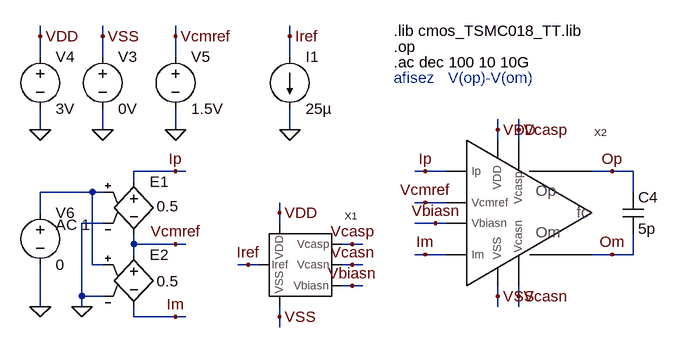
[diagram p0: schematic test_opampFC_ac.asc]
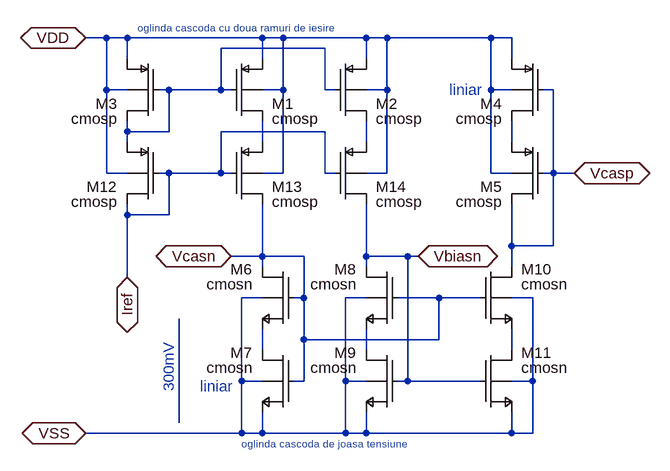
[diagram p1: sub-circuit bias.asc]
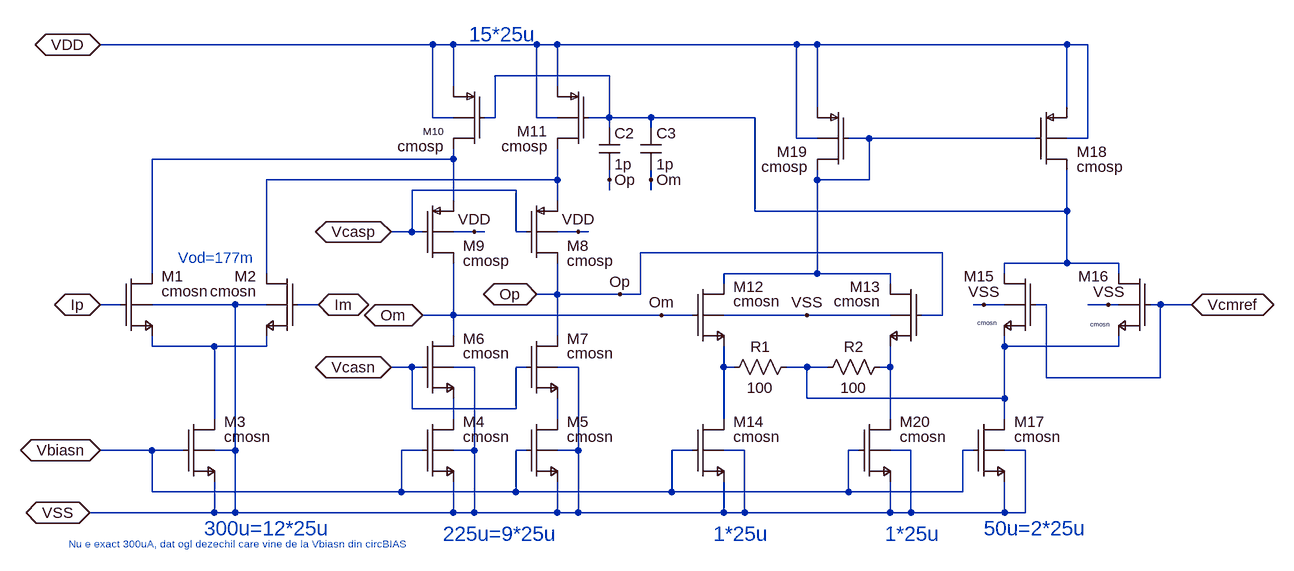
[diagram p2: sub-circuit opampfc.asc]
test_opampFC_ac.asc, the LTspice schematic file:
Version 4
SHEET 1 1072 680
WIRE -432 -432 -432 -448
WIRE -336 -432 -336 -448
WIRE -224 -432 -224 -448
WIRE -48 -432 -48 -448
WIRE -432 -400 -432 -432
WIRE -336 -400 -336 -432
WIRE -224 -400 -224 -432
WIRE -48 -400 -48 -432
WIRE -432 -288 -432 -320
WIRE -336 -288 -336 -320
WIRE -224 -288 -224 -320
WIRE -48 -288 -48 -320
WIRE 272 -288 272 -304
WIRE 304 -288 304 -304
WIRE 272 -272 272 -288
WIRE 304 -272 304 -288
WIRE -224 -224 -288 -224
WIRE -208 -224 -224 -224
WIRE 160 -224 144 -224
WIRE 192 -224 160 -224
WIRE 448 -224 416 -224
WIRE 480 -224 448 -224
WIRE -288 -208 -288 -224
WIRE -352 -192 -432 -192
WIRE -336 -192 -352 -192
WIRE 480 -192 480 -224
WIRE 160 -176 144 -176
WIRE 192 -176 160 -176
WIRE -432 -160 -432 -192
WIRE -64 -160 -64 -176
WIRE -336 -144 -368 -144
WIRE -64 -144 -64 -160
WIRE 176 -144 144 -144
WIRE 192 -144 176 -144
WIRE -288 -112 -288 -128
WIRE -224 -112 -288 -112
WIRE -208 -112 -224 -112
WIRE 48 -112 32 -112
WIRE 64 -112 48 -112
WIRE -288 -96 -288 -112
WIRE 160 -96 144 -96
WIRE 192 -96 160 -96
WIRE 448 -96 416 -96
WIRE 480 -96 480 -128
WIRE 480 -96 448 -96
WIRE -352 -80 -352 -192
WIRE -336 -80 -352 -80
WIRE -112 -80 -128 -80
WIRE -96 -80 -112 -80
WIRE 48 -80 32 -80
WIRE 64 -80 48 -80
WIRE 48 -48 32 -48
WIRE 64 -48 48 -48
WIRE -368 -32 -368 -144
WIRE -336 -32 -368 -32
WIRE 272 -32 272 -48
WIRE 304 -32 304 -48
WIRE -432 -16 -432 -80
WIRE -368 -16 -368 -32
WIRE 272 -16 272 -32
WIRE 304 -16 304 -32
WIRE -288 0 -288 -16
WIRE -224 0 -288 0
WIRE -208 0 -224 0
WIRE -64 0 -64 -16
WIRE -64 16 -64 0
FLAG -336 -288 0
FLAG -432 -288 0
FLAG -432 -432 VDD
FLAG -336 -432 VSS
FLAG -48 -288 0
FLAG -48 -432 Iref
FLAG -224 -288 0
FLAG -224 -432 Vcmref
FLAG -64 -160 VDD
FLAG -112 -80 Iref
FLAG -64 0 VSS
FLAG 48 -112 Vcasp
FLAG 48 -80 Vcasn
FLAG 48 -48 Vbiasn
FLAG -368 -16 0
FLAG -432 -16 0
FLAG -224 -224 Ip
FLAG -224 -112 Vcmref
FLAG -224 0 Im
FLAG 272 -288 VDD
FLAG 304 -288 Vcasp
FLAG 272 -32 VSS
FLAG 176 -144 Vbiasn
FLAG 304 -32 Vcasn
FLAG 160 -224 Ip
FLAG 160 -176 Vcmref
FLAG 160 -96 Im
FLAG 448 -224 Op
FLAG 448 -96 Om
SYMBOL voltage -336 -416 R0
SYMATTR InstName V3
SYMATTR Value 0V
SYMBOL voltage -432 -416 R0
SYMATTR InstName V4
SYMATTR Value 3V
SYMBOL current -48 -400 R0
SYMATTR InstName I1
SYMATTR Value 25µ
SYMBOL voltage -224 -416 R0
SYMATTR InstName V5
SYMATTR Value 1.5V
SYMBOL bias -80 -128 R0
SYMATTR InstName X1
SYMBOL e -288 -224 R0
WINDOW 3 35 54 Left 2
SYMATTR Value 0.5
SYMATTR InstName E1
SYMBOL e -288 -112 R0
WINDOW 3 35 57 Left 2
SYMATTR Value 0.5
SYMATTR InstName E2
SYMBOL voltage -432 -176 R0
WINDOW 123 24 34 Left 2
WINDOW 39 0 0 Left 2
SYMATTR Value2 AC 1
SYMATTR InstName V6
SYMATTR Value 0
SYMBOL cap 464 -192 R0
SYMATTR InstName C4
SYMATTR Value 5p
SYMBOL opampFC 224 -272 R0
SYMATTR InstName X2
TEXT 112 -440 Left 2 !.lib cmos_TSMC018_TT.lib
TEXT 112 -416 Left 2 !.op
TEXT 112 -392 Left 2 !.ac dec 100 10 10G
TEXT 112 -368 Left 2 ;afisez   V(op)-V(om)

bias.asc, the sub-circuit schematic file:
Version 4
SHEET 1 880 716
WIRE -144 48 -176 48
WIRE -112 48 -144 48
WIRE 96 48 -112 48
WIRE 128 48 96 48
WIRE 256 48 128 48
WIRE 288 48 256 48
WIRE 448 48 288 48
WIRE 480 48 448 48
WIRE 192 64 32 64
WIRE -112 80 -112 48
WIRE 96 80 96 48
WIRE 256 80 256 48
WIRE 480 80 480 48
WIRE -144 128 -144 48
WIRE -112 128 -144 128
WIRE -48 128 -64 128
WIRE 32 128 32 64
WIRE 32 128 -48 128
WIRE 48 128 32 128
WIRE 128 128 128 48
WIRE 128 128 96 128
WIRE 192 128 192 64
WIRE 208 128 192 128
WIRE 288 128 288 48
WIRE 288 128 256 128
WIRE 448 128 448 48
WIRE 480 128 448 128
WIRE 544 128 528 128
WIRE -112 192 -112 176
WIRE -48 192 -48 128
WIRE -48 192 -112 192
WIRE 192 192 32 192
WIRE -112 208 -112 192
WIRE 96 208 96 176
WIRE 256 208 256 176
WIRE 480 208 480 176
WIRE -144 256 -144 128
WIRE -112 256 -144 256
WIRE -48 256 -64 256
WIRE 32 256 32 192
WIRE 32 256 -48 256
WIRE 48 256 32 256
WIRE 128 256 128 128
WIRE 128 256 96 256
WIRE 192 256 192 192
WIRE 208 256 192 256
WIRE 288 256 288 128
WIRE 288 256 256 256
WIRE 448 256 448 128
WIRE 480 256 448 256
WIRE 544 256 544 128
WIRE 544 256 528 256
WIRE 576 256 544 256
WIRE -112 320 -112 304
WIRE -48 320 -48 256
WIRE -48 320 -112 320
WIRE 480 368 480 304
WIRE 544 368 544 256
WIRE 544 368 480 368
WIRE 96 384 96 304
WIRE 96 384 48 384
WIRE 160 384 96 384
WIRE 256 384 256 304
WIRE 320 384 256 384
WIRE 336 384 320 384
WIRE 96 400 96 384
WIRE 256 400 256 384
WIRE 480 400 480 368
WIRE -112 416 -112 320
WIRE 96 448 64 448
WIRE 160 448 160 384
WIRE 160 448 144 448
WIRE 256 448 224 448
WIRE 368 448 304 448
WIRE 432 448 368 448
WIRE 512 448 480 448
WIRE 160 512 160 448
WIRE 368 512 368 448
WIRE 368 512 160 512
WIRE 96 528 96 496
WIRE 256 528 256 496
WIRE 480 528 480 496
WIRE 64 576 64 448
WIRE 96 576 64 576
WIRE 160 576 160 512
WIRE 160 576 144 576
WIRE 224 576 224 448
WIRE 256 576 224 576
WIRE 320 576 320 384
WIRE 320 576 304 576
WIRE 432 576 320 576
WIRE 512 576 512 448
WIRE 512 576 480 576
WIRE -32 640 -32 480
WIRE 64 656 64 576
WIRE 64 656 -176 656
WIRE 96 656 96 624
WIRE 96 656 64 656
WIRE 224 656 224 576
WIRE 224 656 96 656
WIRE 256 656 256 624
WIRE 256 656 224 656
WIRE 480 656 480 624
WIRE 480 656 256 656
WIRE 512 656 512 576
WIRE 512 656 480 656
FLAG 336 384 Vbiasn
IOPIN 336 384 BiDir
FLAG 576 256 Vcasp
IOPIN 576 256 BiDir
FLAG 48 384 Vcasn
IOPIN 48 384 BiDir
FLAG -112 416 Iref
IOPIN -112 416 BiDir
FLAG -176 48 VDD
IOPIN -176 48 BiDir
FLAG -176 656 VSS
IOPIN -176 656 BiDir
SYMBOL pmosb 48 80 R0
SYMATTR InstName M1
SYMATTR Value cmosp
SYMATTR Value2 l=1u w=14u ad=2.8p as=2.8p pd=28.4u ps=28.4u m=1
SYMBOL pmosb 208 80 R0
SYMATTR InstName M2
SYMATTR Value cmosp
SYMATTR Value2 l=1u w=14u ad=2.8p as=2.8p pd=28.4u ps=28.4u m=1
SYMBOL pmosb -64 80 M0
SYMATTR InstName M3
SYMATTR Value cmosp
SYMATTR Value2 l=1u w=14u ad=2.8p as=2.8p pd=28.4u ps=28.4u m=1
SYMBOL pmosb 528 80 M0
SYMATTR InstName M4
SYMATTR Value cmosp
SYMATTR Value2 l=2u w=6.3u ad=1.26p as=1.26p pd=13u ps=13u m=1
SYMBOL pmosb 528 208 M0
SYMATTR InstName M5
SYMATTR Value cmosp
SYMATTR Value2 l=1u w=14u ad=2.8p as=2.8p pd=28.4u ps=28.4u m=1
SYMBOL nmosb 144 400 M0
SYMATTR InstName M6
SYMATTR Value cmosn
SYMATTR Value2 l=1u w=2.7u ad=0.54p as=0.54p pd=5.8u ps=5.8u m=1
SYMBOL nmosb 144 528 M0
SYMATTR InstName M7
SYMATTR Value cmosn
SYMATTR Value2 l=2u w=1.3u ad=0.26p as=0.26p pd=3u ps=3u m=1
SYMBOL nmosb 304 400 M0
SYMATTR InstName M8
SYMATTR Value cmosn
SYMATTR Value2 l=1u w=2.7u ad=0.54p as=0.54p pd=5.8u ps=5.8u m=1
SYMBOL nmosb 304 528 M0
SYMATTR InstName M9
SYMATTR Value cmosn
SYMATTR Value2 l=1u w=2.7u ad=0.54p as=0.54p pd=5.8u ps=5.8u m=1
SYMBOL nmosb 432 400 R0
SYMATTR InstName M10
SYMATTR Value cmosn
SYMATTR Value2 l=1u w=2.7u ad=0.54p as=0.54p pd=5.8u ps=5.8u m=1
SYMBOL nmosb 432 528 R0
SYMATTR InstName M11
SYMATTR Value cmosn
SYMATTR Value2 l=1u w=2.7u ad=0.54p as=0.54p pd=5.8u ps=5.8u m=1
SYMBOL pmosb -64 208 M0
SYMATTR InstName M12
SYMATTR Value cmosp
SYMATTR Value2 l=1u w=14u ad=2.8p as=2.8p pd=28.4u ps=28.4u m=1
SYMBOL pmosb 48 208 R0
SYMATTR InstName M13
SYMATTR Value cmosp
SYMATTR Value2 l=1u w=14u ad=2.8p as=2.8p pd=28.4u ps=28.4u m=1
SYMBOL pmosb 208 208 R0
SYMATTR InstName M14
SYMATTR Value cmosp
SYMATTR Value2 l=1u w=14u ad=2.8p as=2.8p pd=28.4u ps=28.4u m=1
TEXT 0 584 Left 2 ;liniar
TEXT 384 128 Left 2 ;liniar
TEXT -48 592 VLeft 2 ;300mV
TEXT 64 672 Left 1 ;oglinda cascoda de joasa tensiune
TEXT -96 32 Left 1 ;oglinda cascoda cu doua ramuri de iesire

opampfc.asc, the sub-circuit schematic file:
Version 4
SHEET 1 1072 680
WIRE -464 -224 -976 -224
WIRE -432 -224 -464 -224
WIRE -304 -224 -432 -224
WIRE -272 -224 -304 -224
WIRE 96 -224 -272 -224
WIRE 128 -224 96 -224
WIRE 512 -224 128 -224
WIRE 544 -224 512 -224
WIRE -192 -176 -368 -176
WIRE -432 -160 -432 -224
WIRE -272 -160 -272 -224
WIRE 128 -128 128 -224
WIRE 512 -128 512 -224
WIRE -464 -112 -464 -224
WIRE -432 -112 -464 -112
WIRE -368 -112 -368 -176
WIRE -368 -112 -384 -112
WIRE -304 -112 -304 -224
WIRE -272 -112 -304 -112
WIRE -192 -112 -192 -176
WIRE -192 -112 -224 -112
WIRE -128 -112 -192 -112
WIRE 32 -112 -128 -112
WIRE -192 -96 -192 -112
WIRE -128 -96 -128 -112
WIRE 96 -80 96 -224
WIRE 128 -80 96 -80
WIRE 208 -80 176 -80
WIRE 464 -80 208 -80
WIRE 544 -80 544 -224
WIRE 544 -80 512 -80
WIRE -432 -48 -432 -64
WIRE -432 -48 -896 -48
WIRE -272 -16 -272 -64
WIRE -272 -16 -720 -16
WIRE -192 -16 -192 -32
WIRE -128 -16 -128 -32
WIRE 128 -16 128 -32
WIRE 208 -16 208 -80
WIRE 208 -16 128 -16
WIRE -336 0 -496 0
WIRE -192 0 -192 -16
WIRE -128 0 -128 -16
WIRE -432 16 -432 -48
WIRE -272 16 -272 -16
WIRE 32 32 32 -112
WIRE 512 32 512 -32
WIRE 512 32 32 32
WIRE -496 64 -496 0
WIRE -496 64 -528 64
WIRE -480 64 -496 64
WIRE -400 64 -432 64
WIRE -384 64 -400 64
WIRE -336 64 -336 0
WIRE -320 64 -336 64
WIRE -240 64 -272 64
WIRE -224 64 -240 64
WIRE 320 96 -144 96
WIRE 512 112 512 32
WIRE 512 112 416 112
WIRE 592 112 512 112
WIRE -896 128 -896 -48
WIRE -720 128 -720 -16
WIRE 128 128 128 -16
WIRE 128 128 -16 128
WIRE 240 128 128 128
WIRE 416 128 416 112
WIRE 592 128 592 112
WIRE -16 144 -16 128
WIRE 240 144 240 128
WIRE -272 160 -272 112
WIRE -272 160 -304 160
WIRE -176 160 -272 160
WIRE -144 160 -144 96
WIRE -144 160 -176 160
WIRE -944 176 -976 176
WIRE -768 176 -896 176
WIRE -720 176 -768 176
WIRE -640 176 -672 176
WIRE 384 176 368 176
WIRE 416 176 384 176
WIRE 480 176 464 176
WIRE 576 176 544 176
WIRE 592 176 576 176
WIRE 656 176 640 176
WIRE 704 176 656 176
WIRE -432 192 -432 112
WIRE -432 192 -480 192
WIRE -112 192 -432 192
WIRE -64 192 -112 192
WIRE 112 192 -16 192
WIRE 240 192 112 192
WIRE 320 192 320 96
WIRE 320 192 288 192
WIRE -432 224 -432 192
WIRE -272 224 -272 160
WIRE -896 240 -896 224
WIRE -800 240 -896 240
WIRE -720 240 -720 224
WIRE -720 240 -800 240
WIRE 416 240 416 224
WIRE 592 240 592 224
WIRE 592 240 416 240
WIRE -496 272 -528 272
WIRE -480 272 -496 272
WIRE -400 272 -432 272
WIRE -320 272 -336 272
WIRE -240 272 -272 272
WIRE -16 272 -16 240
WIRE 0 272 -16 272
WIRE 112 272 80 272
WIRE 144 272 112 272
WIRE 240 272 240 240
WIRE 240 272 224 272
WIRE 480 288 480 176
WIRE 656 288 656 176
WIRE 656 288 480 288
WIRE 112 320 112 272
WIRE 416 320 416 240
WIRE 416 320 112 320
WIRE -496 336 -496 272
WIRE -336 336 -336 272
WIRE -336 336 -496 336
WIRE -800 352 -800 240
WIRE -432 352 -432 320
WIRE -272 352 -272 320
WIRE -16 352 -16 272
WIRE 240 352 240 272
WIRE 416 352 416 320
WIRE -896 400 -976 400
WIRE -848 400 -896 400
WIRE -768 400 -768 176
WIRE -768 400 -800 400
WIRE -480 400 -512 400
WIRE -400 400 -400 272
WIRE -400 400 -432 400
WIRE -320 400 -336 400
WIRE -240 400 -240 272
WIRE -240 400 -272 400
WIRE -64 400 -96 400
WIRE 16 400 -16 400
WIRE 192 400 176 400
WIRE 272 400 240 400
WIRE 368 400 352 400
WIRE 448 400 416 400
WIRE -896 464 -896 400
WIRE -512 464 -512 400
WIRE -512 464 -896 464
WIRE -336 464 -336 400
WIRE -336 464 -512 464
WIRE -96 464 -96 400
WIRE -96 464 -336 464
WIRE 176 464 176 400
WIRE 176 464 -96 464
WIRE 352 464 352 400
WIRE 352 464 176 464
WIRE -800 496 -800 448
WIRE -800 496 -992 496
WIRE -768 496 -768 400
WIRE -768 496 -800 496
WIRE -432 496 -432 448
WIRE -432 496 -768 496
WIRE -400 496 -400 400
WIRE -400 496 -432 496
WIRE -272 496 -272 448
WIRE -272 496 -400 496
WIRE -240 496 -240 400
WIRE -240 496 -272 496
WIRE -16 496 -16 448
WIRE -16 496 -240 496
WIRE 16 496 16 400
WIRE 16 496 -16 496
WIRE 240 496 240 448
WIRE 240 496 16 496
WIRE 272 496 272 400
WIRE 272 496 240 496
WIRE 416 496 416 448
WIRE 416 496 272 496
WIRE 448 496 448 400
WIRE 448 496 416 496
FLAG -976 -224 VDD
IOPIN -976 -224 BiDir
FLAG -992 496 VSS
IOPIN -992 496 BiDir
FLAG -976 400 Vbiasn
IOPIN -976 400 BiDir
FLAG -528 272 Vcasn
IOPIN -528 272 BiDir
FLAG -528 64 Vcasp
IOPIN -528 64 BiDir
FLAG -640 176 Im
IOPIN -640 176 BiDir
FLAG -976 176 Ip
IOPIN -976 176 BiDir
FLAG -400 64 VDD
FLAG -240 64 VDD
FLAG 112 192 VSS
FLAG 704 176 Vcmref
IOPIN 704 176 BiDir
FLAG 384 176 VSS
FLAG -176 160 Op
FLAG -112 192 Om
FLAG -192 -16 Op
FLAG -128 -16 Om
FLAG -304 160 Op
IOPIN -304 160 BiDir
FLAG -480 192 Om
IOPIN -480 192 BiDir
FLAG 576 176 VSS
SYMBOL nmosb -944 128 R0
WINDOW 0 63 4 Left 2
SYMATTR InstName M1
SYMATTR Value cmosn
SYMATTR Value2 l=1u w=5.1u ad=1.02p as=1.02p pd=10.6u ps=10.6u m=5
SYMBOL nmosb -672 128 M0
WINDOW 0 63 4 Left 2
SYMATTR InstName M2
SYMATTR Value cmosn
SYMATTR Value2 l=1u w=5.1u ad=1.02p as=1.02p pd=10.6u ps=10.6u m=5
SYMBOL nmosb -848 352 R0
WINDOW 0 63 4 Left 2
SYMATTR InstName M3
SYMATTR Value cmosn
SYMATTR Value2 l=1u w=2.7u ad=0.54p as=0.54p pd=5.8u ps=5.8u m=12
SYMBOL nmosb -480 352 R0
WINDOW 0 63 4 Left 2
SYMATTR InstName M4
SYMATTR Value cmosn
SYMATTR Value2 l=1u w=2.7u ad=0.54p as=0.54p pd=5.8u ps=5.8u m=9
SYMBOL nmosb -320 352 R0
WINDOW 0 63 4 Left 2
SYMATTR InstName M5
SYMATTR Value cmosn
SYMATTR Value2 l=1u w=2.7u ad=0.54p as=0.54p pd=5.8u ps=5.8u m=9
SYMBOL nmosb -480 224 R0
WINDOW 0 63 4 Left 2
SYMATTR InstName M6
SYMATTR Value cmosn
SYMATTR Value2 l=1u w=2.7u ad=0.54p as=0.54p pd=5.8u ps=5.8u m=9
SYMBOL nmosb -320 224 R0
WINDOW 0 63 4 Left 2
SYMATTR InstName M7
SYMATTR Value cmosn
SYMATTR Value2 l=1u w=2.7u ad=0.54p as=0.54p pd=5.8u ps=5.8u m=9
SYMBOL pmosb -320 16 R0
WINDOW 0 63 69 Left 2
SYMATTR InstName M8
SYMATTR Value cmosp
SYMATTR Value2 l=1u w=14u ad=2.8p as=2.8p pd=28.4u ps=28.4u m=9
SYMBOL pmosb -480 16 R0
WINDOW 0 63 69 Left 2
SYMATTR InstName M9
SYMATTR Value cmosp
SYMATTR Value2 l=1u w=14u ad=2.8p as=2.8p pd=28.4u ps=28.4u m=9
SYMBOL pmosb -384 -160 M0
WINDOW 0 63 69 Left 1
SYMATTR InstName M10
SYMATTR Value cmosp
SYMATTR Value2 l=1u w=14u ad=2.8p as=2.8p pd=28.4u ps=28.4u m=15
SYMBOL pmosb -224 -160 M0
WINDOW 0 63 69 Left 2
SYMATTR InstName M11
SYMATTR Value cmosp
SYMATTR Value2 l=1u w=14u ad=2.8p as=2.8p pd=28.4u ps=28.4u m=15
SYMBOL nmosb -64 144 R0
WINDOW 0 63 4 Left 2
SYMATTR InstName M12
SYMATTR Value cmosn
SYMATTR Value2 l=1u w=2.7u ad=0.54p as=0.54p pd=5.8u ps=5.8u m=1
SYMBOL nmosb 288 144 M0
WINDOW 0 63 4 Left 2
SYMATTR InstName M13
SYMATTR Value cmosn
SYMATTR Value2 l=1u w=2.7u ad=0.54p as=0.54p pd=5.8u ps=5.8u m=1
SYMBOL nmosb -64 352 R0
WINDOW 0 63 4 Left 2
SYMATTR InstName M14
SYMATTR Value cmosn
SYMATTR Value2 l=1u w=2.7u ad=0.54p as=0.54p pd=5.8u ps=5.8u m=1
SYMBOL res 96 256 R90
WINDOW 0 0 56 VBottom 2
WINDOW 3 32 56 VTop 2
SYMATTR InstName R1
SYMATTR Value 100
SYMBOL res 240 256 R90
WINDOW 0 0 56 VBottom 2
WINDOW 3 32 56 VTop 2
SYMATTR InstName R2
SYMATTR Value 100
SYMBOL nmosb 464 128 M0
WINDOW 3 60 76 Left 0
WINDOW 0 63 4 Left 2
SYMATTR Value cmosn
SYMATTR InstName M15
SYMATTR Value2 l=1u w=2.7u ad=0.54p as=0.54p pd=5.8u ps=5.8u m=1
SYMBOL nmosb 640 128 M0
WINDOW 3 62 78 Left 0
WINDOW 0 63 4 Left 2
SYMATTR Value cmosn
SYMATTR InstName M16
SYMATTR Value2 l=1u w=2.7u ad=0.54p as=0.54p pd=5.8u ps=5.8u m=1
SYMBOL nmosb 368 352 R0
WINDOW 0 63 4 Left 2
SYMATTR InstName M17
SYMATTR Value cmosn
SYMATTR Value2 l=1u w=2.7u ad=0.54p as=0.54p pd=5.8u ps=5.8u m=2
SYMBOL pmosb 464 -128 R0
WINDOW 0 63 69 Left 2
SYMATTR InstName M18
SYMATTR Value cmosp
SYMATTR Value2 l=1u w=14u ad=2.8p as=2.8p pd=28.4u ps=28.4u m=2
SYMBOL pmosb 176 -128 M0
WINDOW 0 63 69 Left 2
SYMATTR InstName M19
SYMATTR Value cmosp
SYMATTR Value2 l=1u w=14u ad=2.8p as=2.8p pd=28.4u ps=28.4u m=2
SYMBOL nmosb 192 352 R0
WINDOW 0 63 4 Left 2
SYMATTR InstName M20
SYMATTR Value cmosn
SYMATTR Value2 l=1u w=2.7u ad=0.54p as=0.54p pd=5.8u ps=5.8u m=1
SYMBOL cap -208 -96 R0
SYMATTR InstName C2
SYMATTR Value 1p
SYMBOL cap -144 -96 R0
SYMATTR InstName C3
SYMATTR Value 1p
TEXT -448 528 Left 3 ;225u=9*25u
TEXT -32 528 Left 3 ;1*25u
TEXT 232 528 Left 3 ;1*25u
TEXT 384 520 Left 3 ;50u=2*25u
TEXT -816 520 Left 3 ;300u=12*25u
TEXT -856 104 Left 2 ;Vod=177m
TEXT -1024 544 Left 1 ;Nu e exact 300uA, dat ogl dezechil care vine de la Vbiasn din circBIAS
TEXT -408 -240 Left 3 ;15*25u

The netlist it stands for:
* test_opampFC_ac.asc
V3 VSS 0 0V
V4 VDD 0 3V
I1 Iref 0 25µ
V5 Vcmref 0 1.5V
XX1 VDD Iref VSS Vbiasn Vcasn Vcasp bias
E1 Ip Vcmref N001 0 0.5
E2 Vcmref Im N001 0 0.5
V6 N001 0 0 AC 1
C4 Op Om 5p
XX2 Ip Im Vcmref Op Om VDD Vcasp Vbiasn Vcasn VSS opampfc

* block symbol definitions
.subckt bias VDD Iref VSS Vbiasn Vcasn Vcasp
M1 N002 N001 VDD VDD cmosp l=1u w=14u ad=2.8p as=2.8p pd=28.4u ps=28.4u m=1
M2 N003 N001 VDD VDD cmosp l=1u w=14u ad=2.8p as=2.8p pd=28.4u ps=28.4u m=1
M3 N001 N001 VDD VDD cmosp l=1u w=14u ad=2.8p as=2.8p pd=28.4u ps=28.4u m=1
M4 N004 Vcasp VDD VDD cmosp l=2u w=6.3u ad=1.26p as=1.26p pd=13u ps=13u m=1
M5 Vcasp Vcasp N004 VDD cmosp l=1u w=14u ad=2.8p as=2.8p pd=28.4u ps=28.4u m=1
M6 Vcasn Vcasn N005 VSS cmosn l=1u w=2.7u ad=0.54p as=0.54p pd=5.8u ps=5.8u m=1
M7 N005 Vcasn VSS VSS cmosn l=2u w=1.3u ad=0.26p as=0.26p pd=3u ps=3u m=1
M8 Vbiasn Vcasn N006 VSS cmosn l=1u w=2.7u ad=0.54p as=0.54p pd=5.8u ps=5.8u m=1
M9 N006 Vbiasn VSS VSS cmosn l=1u w=2.7u ad=0.54p as=0.54p pd=5.8u ps=5.8u m=1
M10 Vcasp Vcasn N007 VSS cmosn l=1u w=2.7u ad=0.54p as=0.54p pd=5.8u ps=5.8u m=1
M11 N007 Vbiasn VSS VSS cmosn l=1u w=2.7u ad=0.54p as=0.54p pd=5.8u ps=5.8u m=1
M12 Iref Iref N001 VDD cmosp l=1u w=14u ad=2.8p as=2.8p pd=28.4u ps=28.4u m=1
M13 Vcasn Iref N002 VDD cmosp l=1u w=14u ad=2.8p as=2.8p pd=28.4u ps=28.4u m=1
M14 Vbiasn Iref N003 VDD cmosp l=1u w=14u ad=2.8p as=2.8p pd=28.4u ps=28.4u m=1
* liniar
* liniar
* 300mV
* oglinda cascoda de joasa tensiune
* oglinda cascoda cu doua ramuri de iesire
.ends bias

.subckt opampfc Ip Im Vcmref Op Om VDD Vcasp Vbiasn Vcasn VSS
M1 N003 Ip N005 VSS cmosn l=1u w=5.1u ad=1.02p as=1.02p pd=10.6u ps=10.6u m=5
M2 N004 Im N005 VSS cmosn l=1u w=5.1u ad=1.02p as=1.02p pd=10.6u ps=10.6u m=5
M3 N005 Vbiasn VSS VSS cmosn l=1u w=2.7u ad=0.54p as=0.54p pd=5.8u ps=5.8u m=12
M4 N009 Vbiasn VSS VSS cmosn l=1u w=2.7u ad=0.54p as=0.54p pd=5.8u ps=5.8u m=9
M5 N010 Vbiasn VSS VSS cmosn l=1u w=2.7u ad=0.54p as=0.54p pd=5.8u ps=5.8u m=9
M6 Om Vcasn N009 VSS cmosn l=1u w=2.7u ad=0.54p as=0.54p pd=5.8u ps=5.8u m=9
M7 Op Vcasn N010 VSS cmosn l=1u w=2.7u ad=0.54p as=0.54p pd=5.8u ps=5.8u m=9
M8 Op Vcasp N004 VDD cmosp l=1u w=14u ad=2.8p as=2.8p pd=28.4u ps=28.4u m=9
M9 Om Vcasp N003 VDD cmosp l=1u w=14u ad=2.8p as=2.8p pd=28.4u ps=28.4u m=9
M10 N003 N001 VDD VDD cmosp l=1u w=14u ad=2.8p as=2.8p pd=28.4u ps=28.4u m=15
M11 N004 N001 VDD VDD cmosp l=1u w=14u ad=2.8p as=2.8p pd=28.4u ps=28.4u m=15
M12 N002 Om N007 VSS cmosn l=1u w=2.7u ad=0.54p as=0.54p pd=5.8u ps=5.8u m=1
M13 N002 Op N008 VSS cmosn l=1u w=2.7u ad=0.54p as=0.54p pd=5.8u ps=5.8u m=1
M14 N007 Vbiasn VSS VSS cmosn l=1u w=2.7u ad=0.54p as=0.54p pd=5.8u ps=5.8u m=1
R1 N006 N007 100
R2 N008 N006 100
M15 N001 Vcmref N006 VSS cmosn l=1u w=2.7u ad=0.54p as=0.54p pd=5.8u ps=5.8u m=1
M16 N001 Vcmref N006 VSS cmosn l=1u w=2.7u ad=0.54p as=0.54p pd=5.8u ps=5.8u m=1
M17 N006 Vbiasn VSS VSS cmosn l=1u w=2.7u ad=0.54p as=0.54p pd=5.8u ps=5.8u m=2
M18 N001 N002 VDD VDD cmosp l=1u w=14u ad=2.8p as=2.8p pd=28.4u ps=28.4u m=2
M19 N002 N002 VDD VDD cmosp l=1u w=14u ad=2.8p as=2.8p pd=28.4u ps=28.4u m=2
M20 N008 Vbiasn VSS VSS cmosn l=1u w=2.7u ad=0.54p as=0.54p pd=5.8u ps=5.8u m=1
C2 N001 Op 1p
C3 N001 Om 1p
* 225u=9*25u
* 1*25u
* 1*25u
* 50u=2*25u
* 300u=12*25u
* Vod=177m
* Nu e exact 300uA, dat ogl dezechil care vine de la Vbiasn din circBIAS
* 15*25u
.ends opampfc

.model NMOS NMOS
.model PMOS PMOS
.lib standard.mos
.lib cmos_TSMC018_TT.lib
.op
.ac dec 100 10 10G
* afisez   V(op)-V(om)
.backanno
.end